# EAGLE design doormonitor (EAGLE 6.5.0)
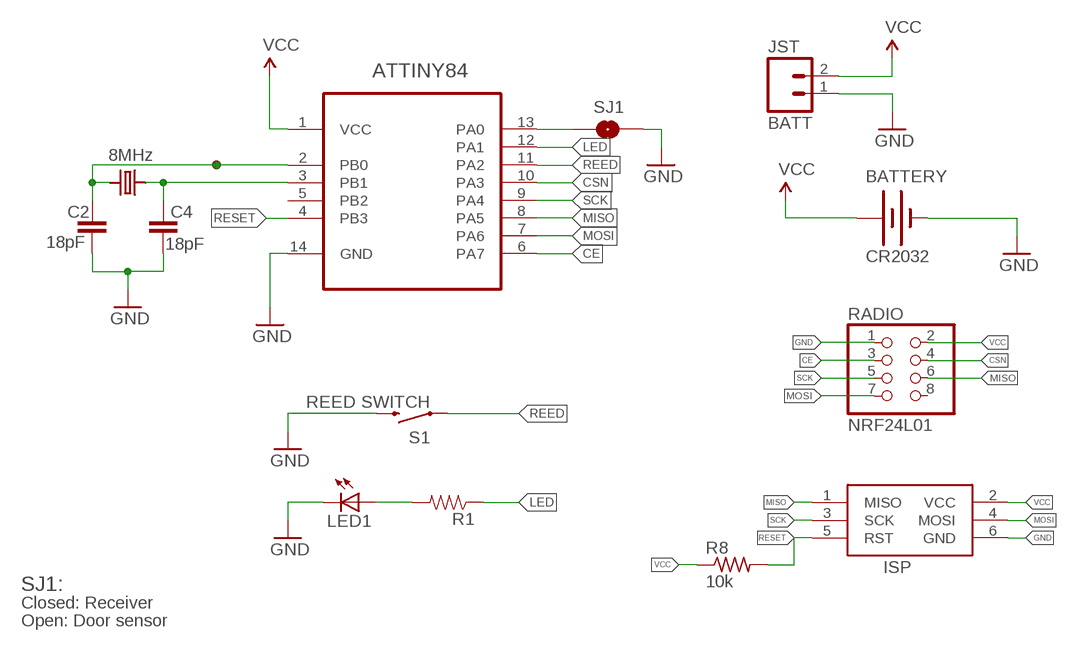
[diagram p0: schematic, sheet 1]

## Parts
ATTINY84  ATTINY84-20SSU  [SOIC127P600X175-14N]
BATTERY  CR2032  BATTERY20MM_4LEGS_OVERPASTE  [BATTCON_20MM_4LEGS_OVERPASTE]
C2  18pF  CAP0805  [0805]
C4  18pF  CAP0805  [0805]
ISP  AVRISP-6  [AVRISP]
JST  BATT  M02JST-PTH-VERT  [JST-2-PTH-VERT]
LED1  LED5MM  [LED5MM]
R1  RESISTOR0805-RES  [0805]
R8  10k  R-US_R0805  [R0805]
RADIO  NRF24L01  PINHD-2X4  [2X04]
S1  REED SWITCH  SWITCH-MOMENTARY-2PTH_REED  [REED_SWITCH_PTH]
SJ1  Receiver?  SOLDERJUMPERNC  [SJ_2S]
U$1  VIA  [FANCYVIA]
Y1  8MHz  CRYSTAL  [NX8045GB]

## Nets
CE: ATTINY84.6(PA7) RADIO.3
CSN: ATTINY84.10(PA3) RADIO.4
GND: ATTINY84.14(GND) BATTERY.2(-) C2.2 C4.2 ISP.6(GND) JST.1 LED1.K(C) RADIO.1 S1.P$2 SJ1.1
LED: ATTINY84.12(PA1) R1.1
MISO: ATTINY84.8(PA5) ISP.1(MISO) RADIO.6
MOSI: ATTINY84.7(PA6) ISP.4(MOSI) RADIO.7
N$2: ATTINY84.13(PA0) SJ1.2
N$3: ATTINY84.2(PB0) C2.1 U$1.VIA Y1.P$2
N$4: ATTINY84.3(PB1) C4.1 Y1.P$1
N$6: LED1.A R1.2
REED: ATTINY84.11(PA2) S1.P$1
RESET: ATTINY84.4(PB3) ISP.5(RST) R8.2
SCK: ATTINY84.9(PA4) ISP.3(SCK) RADIO.5
VCC: ATTINY84.1(VCC) BATTERY.1(+) ISP.2(VCC) JST.2 R8.1 RADIO.2
Unconnected: ATTINY84.5(PB2) RADIO.8

## Notes on the sheet
- SJ1:
- Closed: Receiver
- Open: Door sensor

## Library data of the parts
ATTINY84 = Atmel_By_element14_Batch_1:ATTINY84-20SSU: 8-bit Microcontroller with Bytes In-System Programmable Flash; MPN: ATTINY84-20SSU; OC_FARNELL: 1636955; OC_NEWARK: 03P2040; PACKAGE: SOIC-14; SUPPLIER: Atmel
BATTERY = SparkFun-Electromechanical:BATTERY: Battery Holders Various common sizes : AA, AAA, 20mm coin cell and 12mm coin cell. 20MM_4LEGS, BATT-10373
C2 C4 = SparkFun-Passives:CAP: Capacitor Standard 0603 ceramic capacitor, and 0.1" leaded capacitor.
ISP = adafruit:AVRISP: AVR ISP HEADER Standard 6 pin header for AVR programming
JST = SparkFun-Connectors:M02: Standard 2-pin 0.1" header. Use with - straight break away headers ( PRT-00116) - right angle break away headers (PRT-00553) - swiss pins (PRT-00743) - machine pins (PRT-00117) - female headers (PRT-00115) Molex polarized connector foot print use with: PRT-08233 with associated crimp pins and housings. 2.54_SCREWTERM for use with PRT-10571. 3.5mm Screw Terminal footprints for PRT-08084 5mm Screw Terminal footprints for use with PRT-08433
LED1 = led:LED: LED OSRAM: - CHIPLED LG R971, LG N971, LY N971, LG Q971, LY Q971, LO R971, LY R971 LH N974, LH R974 LS Q976, LO Q976, LY Q976 LO Q996 - Hyper CHIPLED LW Q18S LB Q993, LB Q99A, LB R99A - SideLED LS A670, LO A670, LY A670, LG A670, LP A670 LB A673, LV A673, LT A673, LW A673 LH A674 LY A675 LS A676, LA A676, LO A676, LY A676, LW A676 LS A679, LY A679, LG A679 - Hyper Micro SIDELED® LS Y876, LA Y876, LO Y876, LY Y876 LT Y87S - SmartLED LW L88C, LW L88S LB L89C, LB L89S, LG L890 LS L89K, LO L89K, LY L89K LS L896, LA L896, LO L896, LY L896 - TOPLED LS T670, LO T670, LY T670, LG T670, LP T670 LSG T670, LSP T670, LSY T670, LOP T670, LYG T670 LG T671, LOG T671, LSG T671 LB T673, LV T673, LT T673, LW T673 LH T674 LS T676, LA T676, LO T676, LY T676, LB T676, LH T676, LSB T676, LW T676 LB T67C, LV T67C, LT T67C, LS T67K, LO T67K, LY T67K, LW E67C LS E67B, LA E67B, LO E67B, LY E67B, LB E67C, LV E67C, LT E67C LW T67C LS T679, LY T679, LG T679 LS T770, LO T770, LY T770, LG T770, LP T770 LB T773, LV T773, LT T773, LW T773 LH T774 LS E675, LA E675, LY E675, LS T675 LS T776, LA T776, LO T776, LY T776, LB T776 LHGB T686 LT T68C, LB T68C - Hyper Mini TOPLED® LB M676 - Mini TOPLED Santana® LG M470 LS M47K, LO M47K, LY M47K Source: http://www.osram.convergy.de LUXEON: - LUMILED® LXK2-PW12-R00, LXK2-PW12-S00, LXK2-PW14-U00, LXK2-PW14-V00 LXK2-PM12-R00, LXK2-PM12-S00, LXK2-PM14-U00 LXK2-PE12-Q00, LXK2-PE12-R00, LXK2-PE12-S00, LXK2-PE14-T00, LXK2-PE14-U00 LXK2-PB12-K00, LXK2-PB12-L00, LXK2-PB12-M00, LXK2-PB14-N00, LXK2-PB14-P00, LXK2-PB14-Q00 LXK2-PR12-L00, LXK2-PR12-M00, LXK2-PR14-Q00, LXK2-PR14-R00 LXK2-PD12-Q00, LXK2-PD12-R00, LXK2-PD12-S00 LXK2-PH12-R00, LXK2-PH12-S00 LXK2-PL12-P00, LXK2-PL12-Q00, LXK2-PL12-R00 Source: www.luxeon.com KINGBRIGHT: KA-3528ASYC Source: www.kingbright.com
R1 = SparkFun-Passives:RESISTOR: Resistor Basic schematic elements and footprints for 0603, 1206, and PTH resistors.
R8 = adafruit:R-US_: RESISTOR, American symbol
RADIO = pinhead:PINHD-2X4: PIN HEADER
S1 = SparkFun-Electromechanical:SWITCH-MOMENTARY-2: Various NO switches- pushbuttons, reed, etc
SJ1 = SparkFun-Passives:SOLDERJUMPER: Solder Jumper Standard SMD solder jumper. Used to automate production. Two varients : Normally Open and Normally Closed are the same, but have different paste layers. NC will have a large amount of paste and should jumper during reflow.
U$1 = thinkmaketest:VIA
Y1 = remote:CRYSTAL: Crystals HC49UP - Surface Mount Crystal 4.0MHz 18pF +/-30ppm Surface Mount Crystal [Digikey: 535-9857-1-ND] 12.0 MHz Surface Mount Crystal [Digikey: 535-9869-6-ND] 25.0 MHz Surface Mount Crystal [Digikey: 535-9078-1-ND] 3.2 x 2.5mm - MEMs SMT Crystal 12.0 MHz 8pF 15ppm 3.2 x 2.5mm Crystal [Digikey: 644-1047-1-ND] 16.0 MHz 8pF 15ppm 3.2 x 2.5mm Crystal [Digikey: 644-1049-1-ND] 16.0 MHz 10pF 10ppm 3.2 x 2.5mm Crystal [Digikey: 644-1100-1-ND] 27.12 MHz 18pF 30ppm 3.2 x 2.5mm Crystal [Digikey: 887-1424-1-ND] 4.9 x 1.8mm - MEMs SMT Crystal 32.768 KHz 12.5pF 20ppm 4.9 x 1.8mm Crystal [Digikey: SE2415CT-ND] Cylinder 32.768KHz Cylinder Crystal

## Board
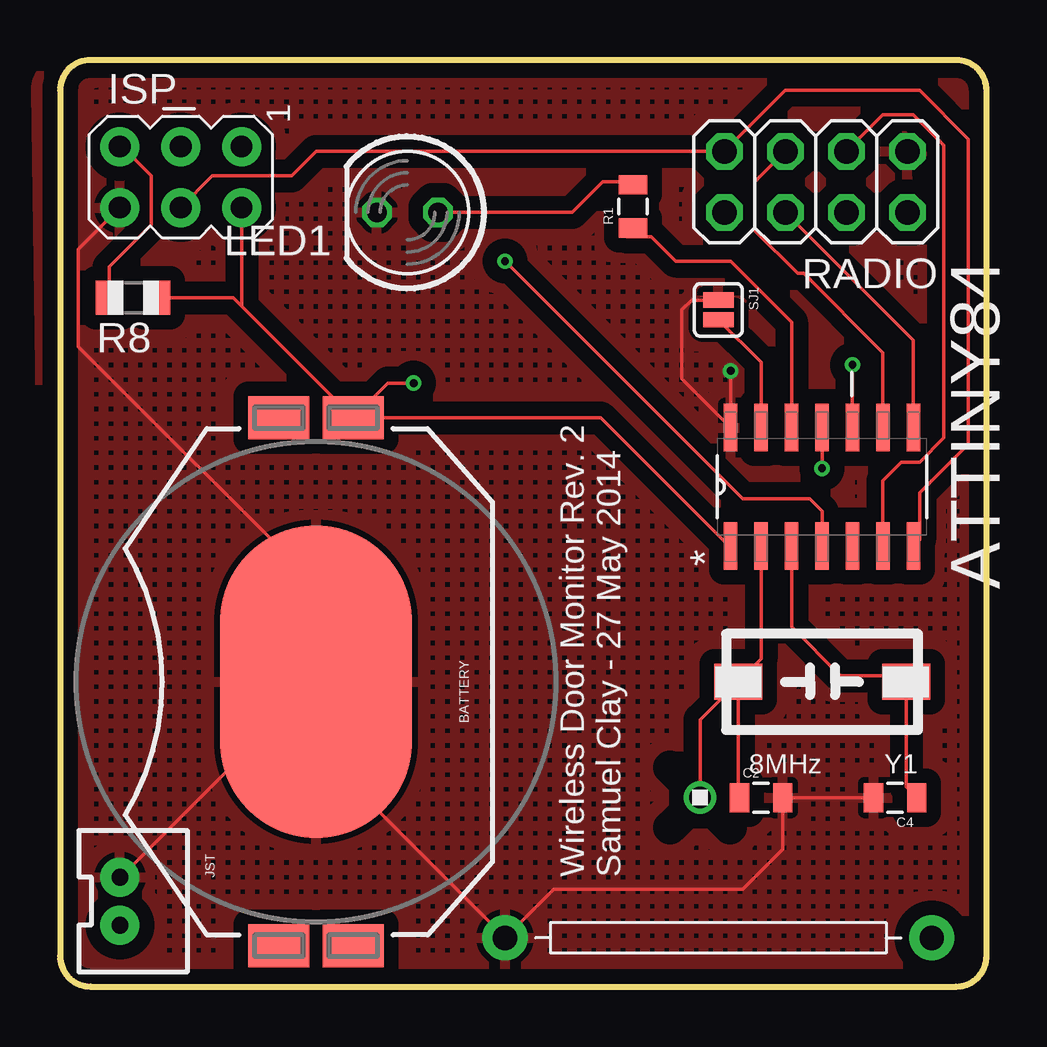
[diagram p1: board, top side]
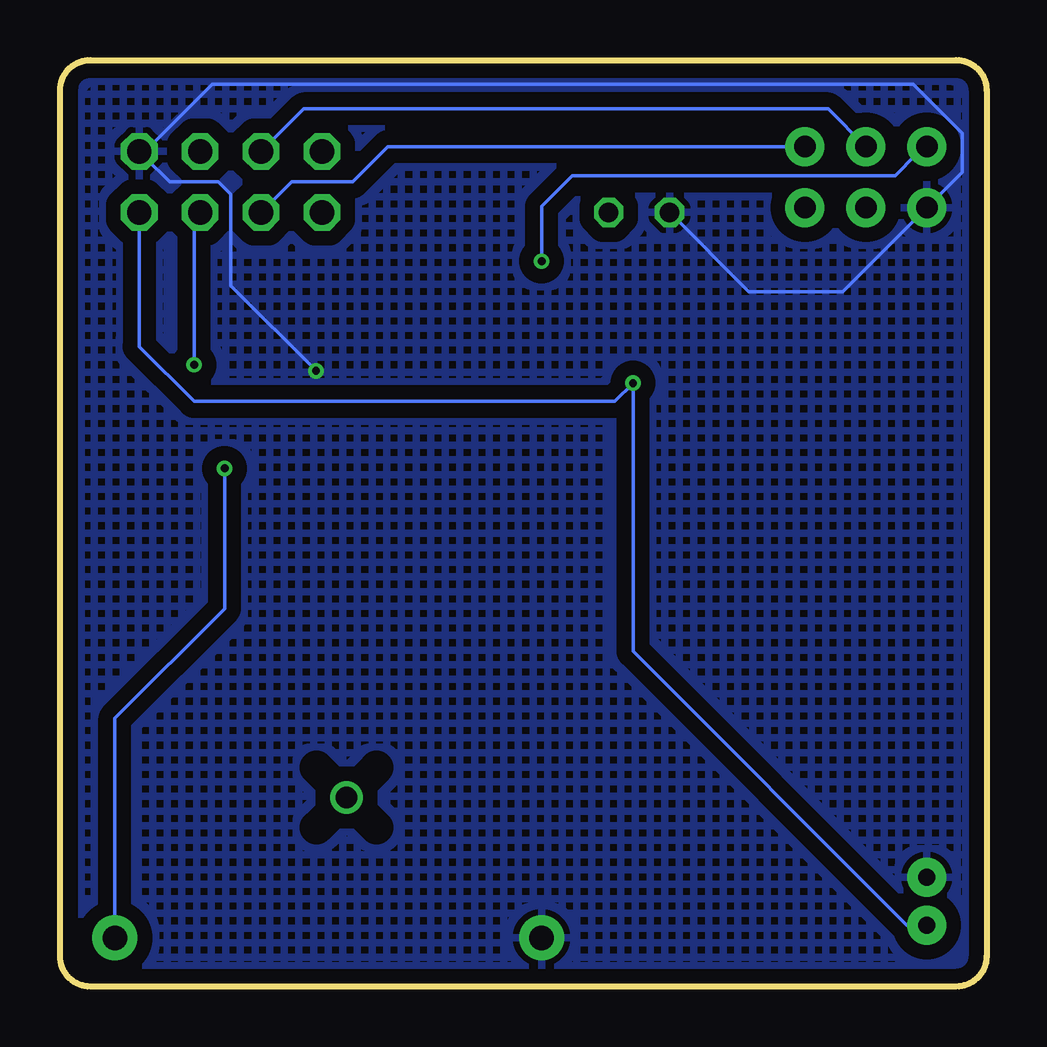
[diagram p2: board, bottom side, seen from below]

Size 38.61 x 38.61 mm. Coordinates in mm from the lower left corner, seen from the top.
Outline: 0,1.27 arc90 1.27,0 37.34,0 arc90 38.61,1.27 38.61,37.34 arc90 37.34,38.61 1.27,38.61 arc90 0,37.34 0,1.27
Copper layers (1*2*15*16): Top 0.035mm / dielectric 0.2mm / Route2 0.0175mm / dielectric 1.1mm / Route15 0.0175mm / dielectric 0.2mm / Bottom 0.035mm
Design rules "SeeedStudio_DRU_no_angle_20130527": minimum track width 6mil, minimum drill 12mil, track to track 6mil, track to pad 6mil, pad to pad 6mil, via to via 6mil, smd to smd 0mil, copper to edge 10mil, drill to drill 10mil, minimum pad ring 6mil, minimum via ring 6mil, stop-mask expansion 2mil, vias tented up to drill 25mil, thermal gap 10mil

### Footprints (pad centres in the part's own frame; a part is rotated, then mirrored left to right if it is on the bottom)
SOIC127P600X175-14N = smd 1.981 x 0.559: 1 -2.464,3.81; 2 -2.464,2.54; 3 -2.464,1.27; 4 -2.464,0; 5 -2.464,-1.27; 6 -2.464,-2.54; 7 -2.464,-3.81; 8 2.464,-3.81; 9 2.464,-2.54; 10 2.464,-1.27; 11 2.464,0; 12 2.464,1.27; 13 2.464,2.54; 14 2.464,3.81
BATTCON_20MM_4LEGS_OVERPASTE = smd 1.778 x 2.54: 1 -11,1.55; 3 11,1.55; P$1 -11,-1.55; P$2 11,-1.55 | smd 13 x 8: 2 0,0
0805 = smd 0.8 x 1.2: 1 -0.9,0; 2 0.9,0
AVRISP = drill 0.9 pad 1.626: 1 -1.27,2.54; 2 1.27,2.54; 3 -1.27,0; 4 1.27,0; 5 -1.27,-2.54; 6 1.27,-2.54
JST-2-PTH-VERT = drill 0.7 pad 1.626: 1 -1,-0.55; 2 1,-0.55
LED5MM = drill 0.813 octagon: A -1.27,0; K 1.27,0
R0805 = smd 1.1 x 1.4: 1 -1,0; 2 1,0
2X04 = drill 1.016 octagon: 1 -3.81,-1.27; 2 -3.81,1.27; 3 -1.27,-1.27; 4 -1.27,1.27; 5 1.27,-1.27; 6 1.27,1.27; 7 3.81,-1.27; 8 3.81,1.27
REED_SWITCH_PTH = drill 1.016 pad 1.88: P$1 -8.89,0; P$2 8.89,0
SJ_2S = smd 0.635 x 1.27: 1 -0.412,0; 2 0.412,0
FANCYVIA = drill 0.9 pad 1.27: VIA 0,0
NX8045GB = smd 2 x 1.5: P$1 -3.5,0; P$2 3.5,0

### Placement (x,y rotation side)
ATTINY84  31.75,20.83 90 top
BATTERY  10.67,12.7 270 top
C2  29.21,7.87 0 top
C4  34.8,7.87 180 top
ISP  5.03,33.73 270 top
JST  3.05,3.56 270 top
LED1  14.48,32.26 180 top
R1  23.88,32.51 90 top
R8  3.05,28.7 180 top
RADIO  31.5,33.53 180 top
S1  27.43,2.03 180 top
SJ1  27.43,28.19 270 top
U$1  26.67,7.87 0 top
Y1  31.75,12.7 180 top

### Tracks (layer width: path | path; a pad name or v marks a point on that pad's centre or on a via)
CE
  Top 0.152: RADIO.3 34.29,36.32 35.56,36.32 36.83,35.05 36.83,22.86 35.81,21.84 35.05,21.84 34.29,21.08 ATTINY84.6
CSN  (via drill 0.33)
  Top 0.152: ATTINY84.10 v33.02,25.91
  Bottom 0.152: v33.02,25.91 33.02,32 RADIO.4
GND  (via drill 0.33)
  Top 0.152: BATTERY.2 10.67,9.91 S1.P$2 20.57,4.06 28.45,4.06 30.11,5.73 C2.2 C4.2 | BATTERY.2 10.67,16.76 0.76,26.67 0.76,30.73 ISP.6 | JST.1 2.52,4.56 BATTERY.2 | SJ1.1 26.32,28.61 25.91,28.19 25.91,25.32 ATTINY84.14 v27.94,25.65
  Bottom 0.152: LED1.K 9.91,28.96 5.99,28.96 ISP.6 1.02,33.93 1.02,35.56 3.05,37.59 32.26,37.59 35.05,34.8 | RADIO.1 35.05,34.8 | 35.05,34.8 35.05,34.54 34.04,33.53 32,33.53 31.5,33.02 31.5,29.21 v27.94,25.65
  pour Bottom (isolate 0.61, hatched): -0.75,37.35 -0.6,1.35 arc90 0.55,-0.6 36.04,-0.5 arc90 38.85,1.1 39.01,37.09 arc90 36.99,38.6 0.5,38.6 arc90
  pour Top (isolate 0.61, hatched): -1.01,37.35 -0.5,1.25 arc90 0.85,-0.6 36.25,-0.75 arc90 38.7,1.4 38.65,37.8 arc90 37,38.75 0.24,38.6 arc90
LED
  Top 0.152: R1.1 23.88,31.5 23.62,31.24 24.64,31.24 25.65,30.23 27.94,30.23 30.48,27.69 ATTINY84.12
MISO
  Top 0.152: RADIO.6 35.56,26.92 ATTINY84.8
  Bottom 0.152: ISP.1 24.95,35 26.42,33.53 28.96,33.53 RADIO.6
MOSI
  Top 0.152: ISP.4 6.35,33.78 9.65,33.78 10.67,34.8 RADIO.7 30.23,37.34 35.81,37.34 37.85,35.31 37.85,22.61 35.81,20.57 35.81,18.62 ATTINY84.7
N$2
  Top 0.152: ATTINY84.13 29.21,26 SJ1.2
N$3
  Top 0.152: ATTINY84.2 29.21,13.66 Y1.P$2 | Y1.P$2 28.25,7.93 C2.1 | U$1.VIA 26.67,11.12 Y1.P$2
N$4
  Top 0.152: ATTINY84.3 30.48,14.99 32.51,12.95 35,12.95 Y1.P$1 35.25,8.32 C4.1
N$6
  Top 0.152: LED1.A 21.34,32.26 22.61,33.53 23.76,33.53 R1.2
REED  (via drill 0.33)
  Top 0.152: v31.75,21.59 ATTINY84.11
  Bottom 0.152: S1.P$1 36.32,11.18 31.75,15.75 v31.75,21.59
RESET  (via drill 0.33)
  Top 0.152: ISP.5 2.59,35 3.81,33.78 3.81,31.75 2.05,29.99 R8.2 | ATTINY84.4 31.75,19.81 31.24,20.32 28.45,20.32 v18.54,30.23
  Bottom 0.152: v18.54,30.23 18.54,32.51 17.27,33.78 3.81,33.78 2.92,34.67 2.82,34.67 ISP.5
SCK
  Top 0.152: RADIO.5 28.96,33.53 28.96,31.5 30.73,29.72 30.99,29.72 34.29,26.42 ATTINY84.9
  Bottom 0.152: ISP.3 6.6,36.58 28.45,36.58 RADIO.5
VCC  (via drill 0.33)
  Top 0.152: BATTERY.1 22.52,23.7 27.86,18.36 ATTINY84.1 | ISP.2 7.57,28.35 BATTERY.1 | R8.1 7.22,28.7 BATTERY.1 | v14.73,25.15 13.66,25.15 BATTERY.1
  Bottom 0.152: RADIO.2 35.31,26.67 33.02,24.38 15.49,24.38 v14.73,25.15 14.73,13.97 3.32,2.56 JST.2

### Text on the board
tNames: Wireless Door Monitor Rev. 2 / Samuel Clay - 27 May 2014